# EAGLE design GPIO_interface (EAGLE 6.6.0)
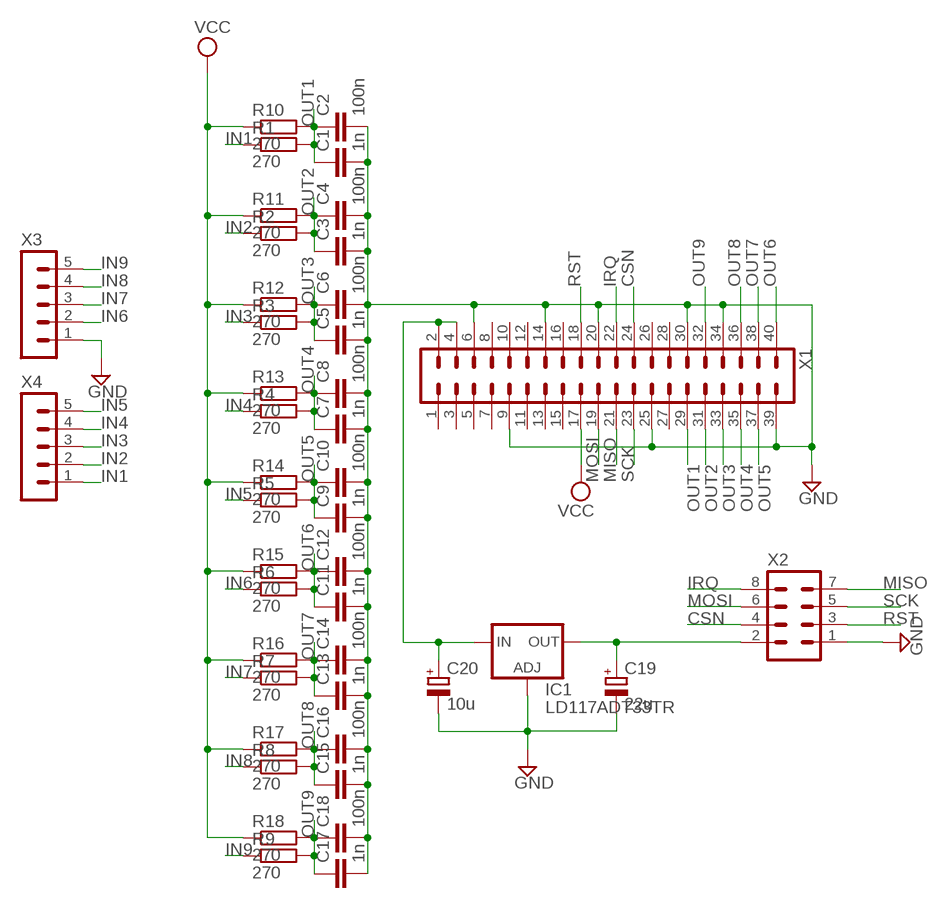
[diagram p0: schematic, sheet 1]

## Parts
C1  1n  C-EUC0603  [C0603]
C2  100n  C-EUC0603  [C0603]
C3  1n  C-EUC0603  [C0603]
C4  100n  C-EUC0603  [C0603]
C5  1n  C-EUC0603  [C0603]
C6  100n  C-EUC0603  [C0603]
C7  1n  C-EUC0603  [C0603]
C8  100n  C-EUC0603  [C0603]
C9  1n  C-EUC0603  [C0603]
C10  100n  C-EUC0603  [C0603]
C11  1n  C-EUC0603  [C0603]
C12  100n  C-EUC0603  [C0603]
C13  1n  C-EUC0603  [C0603]
C14  100n  C-EUC0603  [C0603]
C15  1n  C-EUC0603  [C0603]
C16  100n  C-EUC0603  [C0603]
C17  1n  C-EUC0603  [C0603]
C18  100n  C-EUC0603  [C0603]
C19  22u  CPOL-EUC/6032-28R  [C/6032-28R]
C20  10u  CPOL-EUC/6032-28R  [C/6032-28R]
IC1  LD117ADT33TR  [DPACK]
R1  270  R-EU_R0603  [R0603]
R2  270  R-EU_R0603  [R0603]
R3  270  R-EU_R0603  [R0603]
R4  270  R-EU_R0603  [R0603]
R5  270  R-EU_R0603  [R0603]
R6  270  R-EU_R0603  [R0603]
R7  270  R-EU_R0603  [R0603]
R8  270  R-EU_R0603  [R0603]
R9  270  R-EU_R0603  [R0603]
R10  270  R-EU_R0603  [R0603]
R11  270  R-EU_R0603  [R0603]
R12  270  R-EU_R0603  [R0603]
R13  270  R-EU_R0603  [R0603]
R14  270  R-EU_R0603  [R0603]
R15  270  R-EU_R0603  [R0603]
R16  270  R-EU_R0603  [R0603]
R17  270  R-EU_R0603  [R0603]
R18  270  R-EU_R0603  [R0603]
X1  MA20-2  [MA20-2]
X2  MA04-2  [MA04-2]
X3  MA05-1  [MA05-1]
X4  MA05-1  [MA05-1]

## Nets
CSN: X1.24 X2.4
GND [VCC]: C1.2 C2.2 C3.2 C4.2 C5.2 C6.2 C7.2 C8.2 C9.2 C10.2 C11.2 C12.2 C13.2 C14.2 C15.2 C16.2 C17.2 C18.2 C19.- C20.- IC1.1(ADJ) X1.6 X1.9 X1.14 X1.20 X1.25 X1.30 X1.34 X1.39 X2.1 X3.1
IN1: R1.1 X4.1
IN2: R2.1 X4.2
IN3: R3.1 X4.3
IN4: R4.1 X4.4
IN5: R5.1 X4.5
IN6: R6.1 X3.2
IN7: R7.1 X3.3
IN8: R8.1 X3.4
IN9: R9.1 X3.5
IRQ: X1.22 X2.8
MISO: X1.21 X2.7
MOSI: X1.19 X2.6
N$1 [VCC]: C20.+ IC1.3(IN) X1.2 X1.4
N$2 [VCC]: C19.+ IC1.4(OUT) X2.2
OUT1: C1.1 C2.1 R1.2 R10.2 X1.29
OUT2: C3.1 C4.1 R2.2 R11.2 X1.31
OUT3: C5.1 C6.1 R3.2 R12.2 X1.33
OUT4: C7.1 C8.1 R4.2 R13.2 X1.35
OUT5: C9.1 C10.1 R5.2 R14.2 X1.37
OUT6: C11.1 C12.1 R6.2 R15.2 X1.40
OUT7: C13.1 C14.1 R7.2 R16.2 X1.38
OUT8: C15.1 C16.1 R8.2 R17.2 X1.36
OUT9: C17.1 C18.1 R9.2 R18.2 X1.32
RST: X1.18 X2.3
SCK: X1.23 X2.5
VCC [VCC]: R10.1 R11.1 R12.1 R13.1 R14.1 R15.1 R16.1 R17.1 R18.1 X1.17
Unconnected: X1.1 X1.3 X1.5 X1.7 X1.8 X1.10 X1.11 X1.12 X1.13 X1.15 X1.16 X1.26 X1.27 X1.28

## Library data of the parts
C1-C18 = rcl:C-EU: CAPACITOR, European symbol
C19 C20 = rcl:CPOL-EU: POLARIZED CAPACITOR, European symbol
IC1 = v-reg:LD117A?*: Low drop fixed and adjustable positive voltage regulators 1 A Source: http://www.st.com/stonline/products/literature/ds/7194/ld1117axx.pdf
R1-R18 = rcl:R-EU_: RESISTOR, European symbol
X1 = con-lstb:MA20-2: PIN HEADER; OC_FARNELL: unknown; OC_NEWARK: unknown
X2 = con-lstb:MA04-2: PIN HEADER; OC_FARNELL: unknown; OC_NEWARK: unknown
X3 X4 = con-lstb:MA05-1: PIN HEADER; OC_FARNELL: unknown; OC_NEWARK: unknown

## Net classes
0 default: width 0.254 mm, drill 0.254 mm, clearance 0.254 mm
1 VCC: width 0.508 mm, drill 0.254 mm, clearance 0.254 mm

## Board
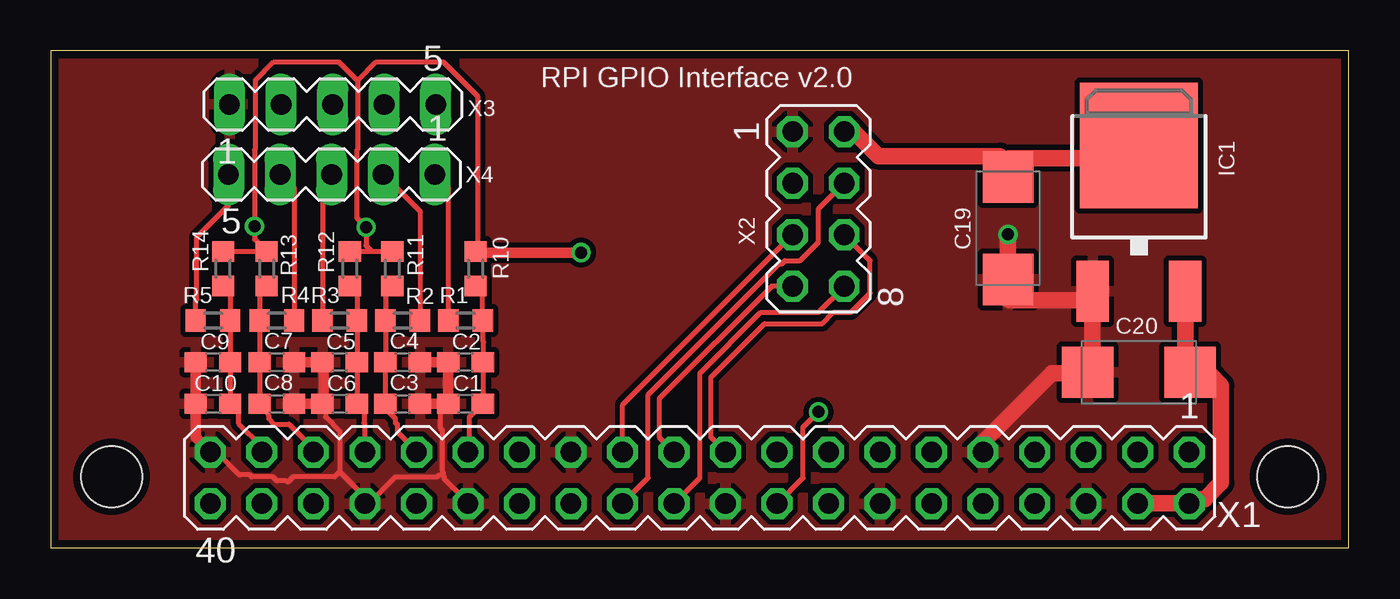
[diagram p1: board, top side]
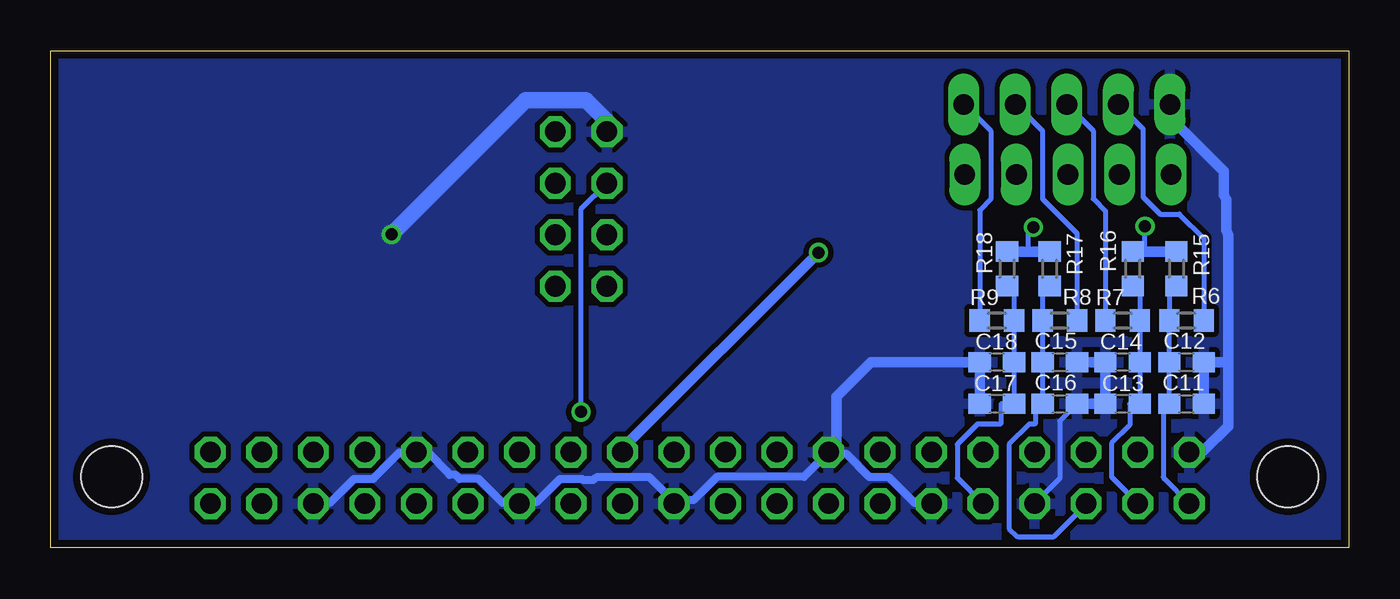
[diagram p2: board, bottom side, seen from below]

Size 64 x 24.5 mm. Coordinates in mm from the lower left corner, seen from the top.
Outline: 0,0 64,0 64,24.5 0,24.5 0,0
Copper layers (1*16): Top 0.0356mm / dielectric 1.5011mm / Bottom 0.0356mm
Design rules "PCBs_io": minimum track width 6mil, minimum drill 13mil, track to track 6mil, track to pad 6mil, pad to pad 6mil, via to via 6mil, smd to smd 6mil, copper to edge 15mil, drill to drill 6mil, minimum pad ring 7mil, minimum via ring 7mil, stop-mask expansion 3mil, vias tented up to drill 0mil, thermal gap 10mil
Holes 3 mm at 3,3.5 61,3.5

### Footprints (pad centres in the part's own frame; a part is rotated, then mirrored left to right if it is on the bottom)
C0603 = smd 1.1 x 1: 1 -0.85,0; 2 0.85,0
C/6032-28R = smd 2.55 x 2.5: + 2.525,0; - -2.525,0
DPACK = smd 1.6 x 3: 1 -2.28,-4.8; 3 2.28,-4.8 | smd 5.8 x 6.2: 4 0,2.38
R0603 = smd 1 x 1.1: 1 -0.85,0; 2 0.85,0
MA20-2 = drill 1.016 octagon: 1 -24.13,-1.27; 2 -24.13,1.27; 3 -21.59,-1.27; 4 -21.59,1.27; 5 -19.05,-1.27; 6 -19.05,1.27; 7 -16.51,-1.27; 8 -16.51,1.27; 9 -13.97,-1.27; 10 -13.97,1.27; 11 -11.43,-1.27; 12 -11.43,1.27; 13 -8.89,-1.27; 14 -8.89,1.27; 15 -6.35,-1.27; 16 -6.35,1.27; 17 -3.81,-1.27; 18 -3.81,1.27; 19 -1.27,-1.27; 20 -1.27,1.27; 21 1.27,-1.27; 22 1.27,1.27; 23 3.81,-1.27; 24 3.81,1.27; 25 6.35,-1.27; 26 6.35,1.27; 27 8.89,-1.27; 28 8.89,1.27; 29 11.43,-1.27; 30 11.43,1.27; 31 13.97,-1.27; 32 13.97,1.27; 33 16.51,-1.27; 34 16.51,1.27; 35 19.05,-1.27; 36 19.05,1.27; 37 21.59,-1.27; 38 21.59,1.27; 39 24.13,-1.27; 40 24.13,1.27
MA04-2 = drill 1.016 octagon: 1 -3.81,-1.27; 2 -3.81,1.27; 3 -1.27,-1.27; 4 -1.27,1.27; 5 1.27,-1.27; 6 1.27,1.27; 7 3.81,-1.27; 8 3.81,1.27
MA05-1 = drill 1.016 long: 1 -5.08,0; 2 -2.54,0; 3 0,0; 4 2.54,0; 5 5.08,0

### Placement (x,y rotation side)
C1  20.45,7.1 180 top
C2  20.45,9.15 180 top
C3  17.35,7.1 0 top
C4  17.35,9.15 0 top
C5  14.25,9.15 180 top
C6  14.25,7.1 180 top
C7  11.15,9.15 0 top
C8  11.15,7.1 0 top
C9  8,9.15 180 top
C10  8,7.1 180 top
C11  8,7.1 0 bottom
C12  8,9.15 0 bottom
C13  11.15,7.1 180 bottom
C14  11.15,9.15 180 bottom
C15  14.25,9.15 0 bottom
C16  14.25,7.1 0 bottom
C17  17.35,7.1 180 bottom
C18  17.35,9.15 180 bottom
C19  47.2,15.75 90 top
C20  53.65,8.65 0 top
IC1  53.65,17.45 0 top
R1  20.45,11.2 0 top
R2  17.35,11.2 180 top
R3  14.25,11.2 0 top
R4  11.15,11.2 180 top
R5  8,11.2 0 top
R6  8,11.2 180 bottom
R7  11.15,11.2 0 bottom
R8  14.25,11.2 180 bottom
R9  17.35,11.2 0 bottom
R10  20.95,13.75 270 top
R11  16.85,13.75 270 top
R12  14.75,13.75 270 top
R13  10.65,13.75 270 top
R14  8.5,13.75 270 top
R15  8.5,13.75 270 bottom
R16  10.65,13.75 270 bottom
R17  14.75,13.75 270 bottom
R18  16.85,13.75 270 bottom
X1  32,3.45 180 top
X2  37.85,16.7 270 top
X3  13.9,21.85 0 top
X4  13.85,18.4 180 top

### Tracks (layer width: path | path; a pad name or v marks a point on that pad's centre or on a via)
CSN
  Top 0.254: X2.4 37.85,16.7 37.85,15.05 36.95,14.15 36.2,14.15 36.05,14 35.9,14 29.45,7.55 29.45,3.45 28.2,2.2 X1.24
GND  (via drill 0.6)
  Top 0.254: 14.25,3.75 15.4,2.6 15.4,2.27 X1.34 15.56,2.25 15.75,2.25 17,3.5 19.05,3.5 19.15,3.6 19.35,3.6 | 14.25,3.75 14.25,5.75 13.55,6.45 13.55,6.85 C16.2 | 19.35,3.6 19.35,3.7 19.3,3.75 19.3,5.8 19.2,5.9 19.2,6.85 C1.2 | 19.35,3.6 19.4,3.5 19.4,3.4 20.4,2.4 20.45,2.3 X1.30 | 14.25,3.75 14,3.5 11.95,3.5 11.7,3.25 11.6,3.3 11.15,3.3 10.95,3.5 9.9,3.5 9.8,3.6 9.3,3.6 8.25,4.65 7.94,4.65 X1.39
  Top 0.508: C14.2 C15.2 13.45,8.9 13.45,7.1 C16.2 C13.2 | C17.2 C1.2 C2.2 C18.2 | C12.2 C11.2 7.15,5.46 | 7.15,5.46 7.19,5.46 | 7.15,5.46 7.15,5.44 X1.39
  Top 0.813: v47.2,15.45 C19.- 47.2,12.25 47.25,12.2 50.95,12.2 IC1.1 51.35,12.65 51.35,8.65 C20.- 50.15,8.65 50.1,8.6 49.35,8.6 46,5.25 46,4.75 X1.9
  Bottom 0.254: 7.85,4.8 7.85,4.74 X1.39 | X1.34 14.25,3.42 14.25,6.25 C16.2
  Bottom 0.406: X1.6 51.05,2.2 50.25,2.2 49.05,3.4 48.1,3.4 46.8,4.7 46,4.7 X1.9 45.8,4.6 45.3,4.6 44.45,3.75 44.35,3.6 44.05,3.6 43.85,3.4 42.9,3.4 41.7,2.2 40.9,2.2 X1.14 40.7,2.25 40.05,2.25 38.9,3.4 37.8,3.4 37.75,3.35 37.25,3.35 37.2,3.4 37.05,3.5 34.5,3.5 33.3,2.3 33.3,2.2 X1.20 33.1,2.35 32.3,2.35 31.15,3.5 26.85,3.5 25.65,4.7 X1.25 25.45,4.65 24.8,4.65 23.65,3.5 22.7,3.5 21.4,2.2 20.6,2.2 X1.30
  Bottom 0.508: C17.2 C18.2 23.55,9.15 25.25,7.45 25.25,5.12 X1.25 | 7.85,4.8 7.15,4.8 5.95,6 5.95,9.05 | 5.95,9.05 5.95,15.4 6.05,15.65 6.05,17.15 6.15,17.4 6.15,18.55 8.8,21.2 8.8,21.85 X3.1 | C15.2 C14.2 C13.2 C16.2 | C11.2 C12.2 6.05,9.15 5.95,9.05
  Bottom 0.813: v47.2,15.45 40.6,22.05 37.6,22.05 36.6,21.05 36.6,20.55 X2.1
  pour Top: 0,0 64,0 64,24.5 0,24.5
  pour Bottom: 0,0 64,0 64,24.5 0,24.5
IN1
  Top 0.254: R1.1 19.6,17.75 18.95,18.4 X4.1
IN2
  Top 0.254: R2.1 18.2,16.6 X4.2
IN3
  Top 0.254: R3.1 13.4,17.95 X4.3
IN4
  Top 0.254: R4.1 12,17.75 11.35,18.4 X4.4
IN5
  Top 0.254: R5.1 7.15,12.2 7.2,12.25 7.2,15.3 8.75,16.85 8.75,18.4 X4.5
IN6
  Bottom 0.254: R6.1 7.15,15.25 8.35,16.45 9.3,16.45 10.15,17.3 10.15,20.65 X3.2
IN7
  Bottom 0.254: R7.1 12,16.6 12.6,17.2 12.6,20.55 X3.3
IN8
  Bottom 0.254: R8.1 13.4,15.5 15.1,17.2 15.1,20.55 16.4,21.85 X3.4
IN9
  Bottom 0.254: R9.1 18.2,16.65 17.65,17.2 17.65,20.55 18.95,21.85 X3.5
IRQ
  Top 0.254: X1.22 32,3.45 32,8.6 35,11.6 37.85,11.6 39.1,12.85 X2.8
MISO
  Top 0.254: X1.21 30,5.45 30,7.35 35.55,12.9 36.55,12.9 X2.7
MOSI
  Top 0.254: X2.6 40.4,14.15 40.4,12.55 39.45,11.6 38.6,11.6 38.05,11.05 35.2,11.05 32.55,8.4 32.55,5.45 33.25,4.75 X1.19
N$1
  Top 0.813: X1.4 53.6,2.2 56.1,2.2 X1.2 56.5,2.4 56.9,2.4 57.7,3.2 57.7,8 57.05,8.65 C20.+ 56.05,9.05 55.95,9.15 55.95,12.65 IC1.3
N$2
  Top 0.813: IC1.4 53.65,19.2 47.25,19.2 47.2,19.15 C19.+ 46.8,19.3 40.8,19.3 39.6,20.5 39.15,20.5 X2.2
OUT1
  Top 0.254: X1.29 20.65,4.8 20.65,6.45 C1.1 21.35,7.1 21.35,9.05 C2.1 21.35,9.15 21.35,10.15 21.3,10.2 R1.2 21.3,12.55 R10.2 21.3,12.85
OUT2
  Top 0.254: R11.2 16.5,12.9 R2.2 C4.1 C3.1 16.5,6.85 17,6.35 17,6.15 17.1,6.1 17.1,5.7 18.05,4.75 X1.31
OUT3
  Top 0.254: R12.2 15.1,12.9 R3.2 C5.1 C6.1 15.45,7.1 15.45,6.15 15.5,6.1 15.5,4.75 X1.33
OUT4
  Top 0.254: R13.2 10.3,12.9 R4.2 C7.1 C8.1 10.7,7.1 10.7,6.6 10.75,6.5 10.75,6.35 11,6.1 11.75,6.1 12.95,4.9 12.95,4.75 X1.35
OUT5
  Top 0.254: R14.2 8.85,12.9 R5.2 C9.1 C10.1 9.25,7.1 9.25,6.15 10.4,5 10.4,4.75 X1.37
OUT6
  Bottom 0.254: R15.2 8.85,12.9 R6.2 C12.1 C11.1 9.15,7.1 9.15,3.5 9.1,3.4 7.9,2.2 X1.40
OUT7
  Bottom 0.254: R16.2 10.3,12.9 R7.2 C14.1 C13.1 10.8,7.1 10.8,6.05 11.7,5.15 11.7,3.5 10.4,2.2 X1.38
OUT8
  Bottom 0.254: R17.2 15.1,12.9 R8.2 C15.1 C16.1 15.45,7.1 15.45,6.15 15.5,6.1 15.75,6.1 16.75,5.1 16.75,0.95 16.35,0.55 14.55,0.55 12.95,2.15 X1.36
OUT9
  Bottom 0.254: R18.2 16.5,12.9 R9.2 C18.1 C17.1 17.15,7.1 17.15,6.15 17.2,6.1 18.3,6.1 19.3,5.1 19.3,3.45 X1.32
RST  (via drill 0.6)
  Top 0.254: v37.85,6.7 37.1,5.95 37.1,3.45 35.85,2.2 X1.18
  Bottom 0.254: X2.3 37.85,16.7 v37.85,6.7
SCK
  Top 0.254: X2.5 28.2,7.05 28.2,4.75 X1.23
VCC  (via drill 0.6)
  Top 0.254: R18.1 15.85,14.6 | R15.1 R16.1 10.05,15.2 v10.05,15.85 10.05,19.6 10.1,19.65 10.1,23.05 11,23.95 14.2,23.95 15.05,23.1 15.15,23.05 | 15.15,23.05 16.05,23.95 19.35,23.95 21.05,22.25 21.05,14.7 R10.1 21.05,14.65 | 15.15,23.05 15.15,19.65 15.1,19.6 15.1,16.25 v15.55,15.8 15.55,14.9 15.85,14.6 | 15.85,14.6 R17.1
  Top 0.508: v26.15,14.55 21,14.55 R10.1
  Bottom 0.254: v15.55,15.8 15.8,15.55 15.8,14.65 15.85,14.6 R18.1 | v10.05,15.85 10.05,14.6 R16.1
  Bottom 0.508: v26.15,14.55 35.8,4.9 35.8,4.75 X1.17 | R15.1 R16.1 | R17.1 R18.1

### Text on the board
tNames: RPI GPIO Interface v2.0